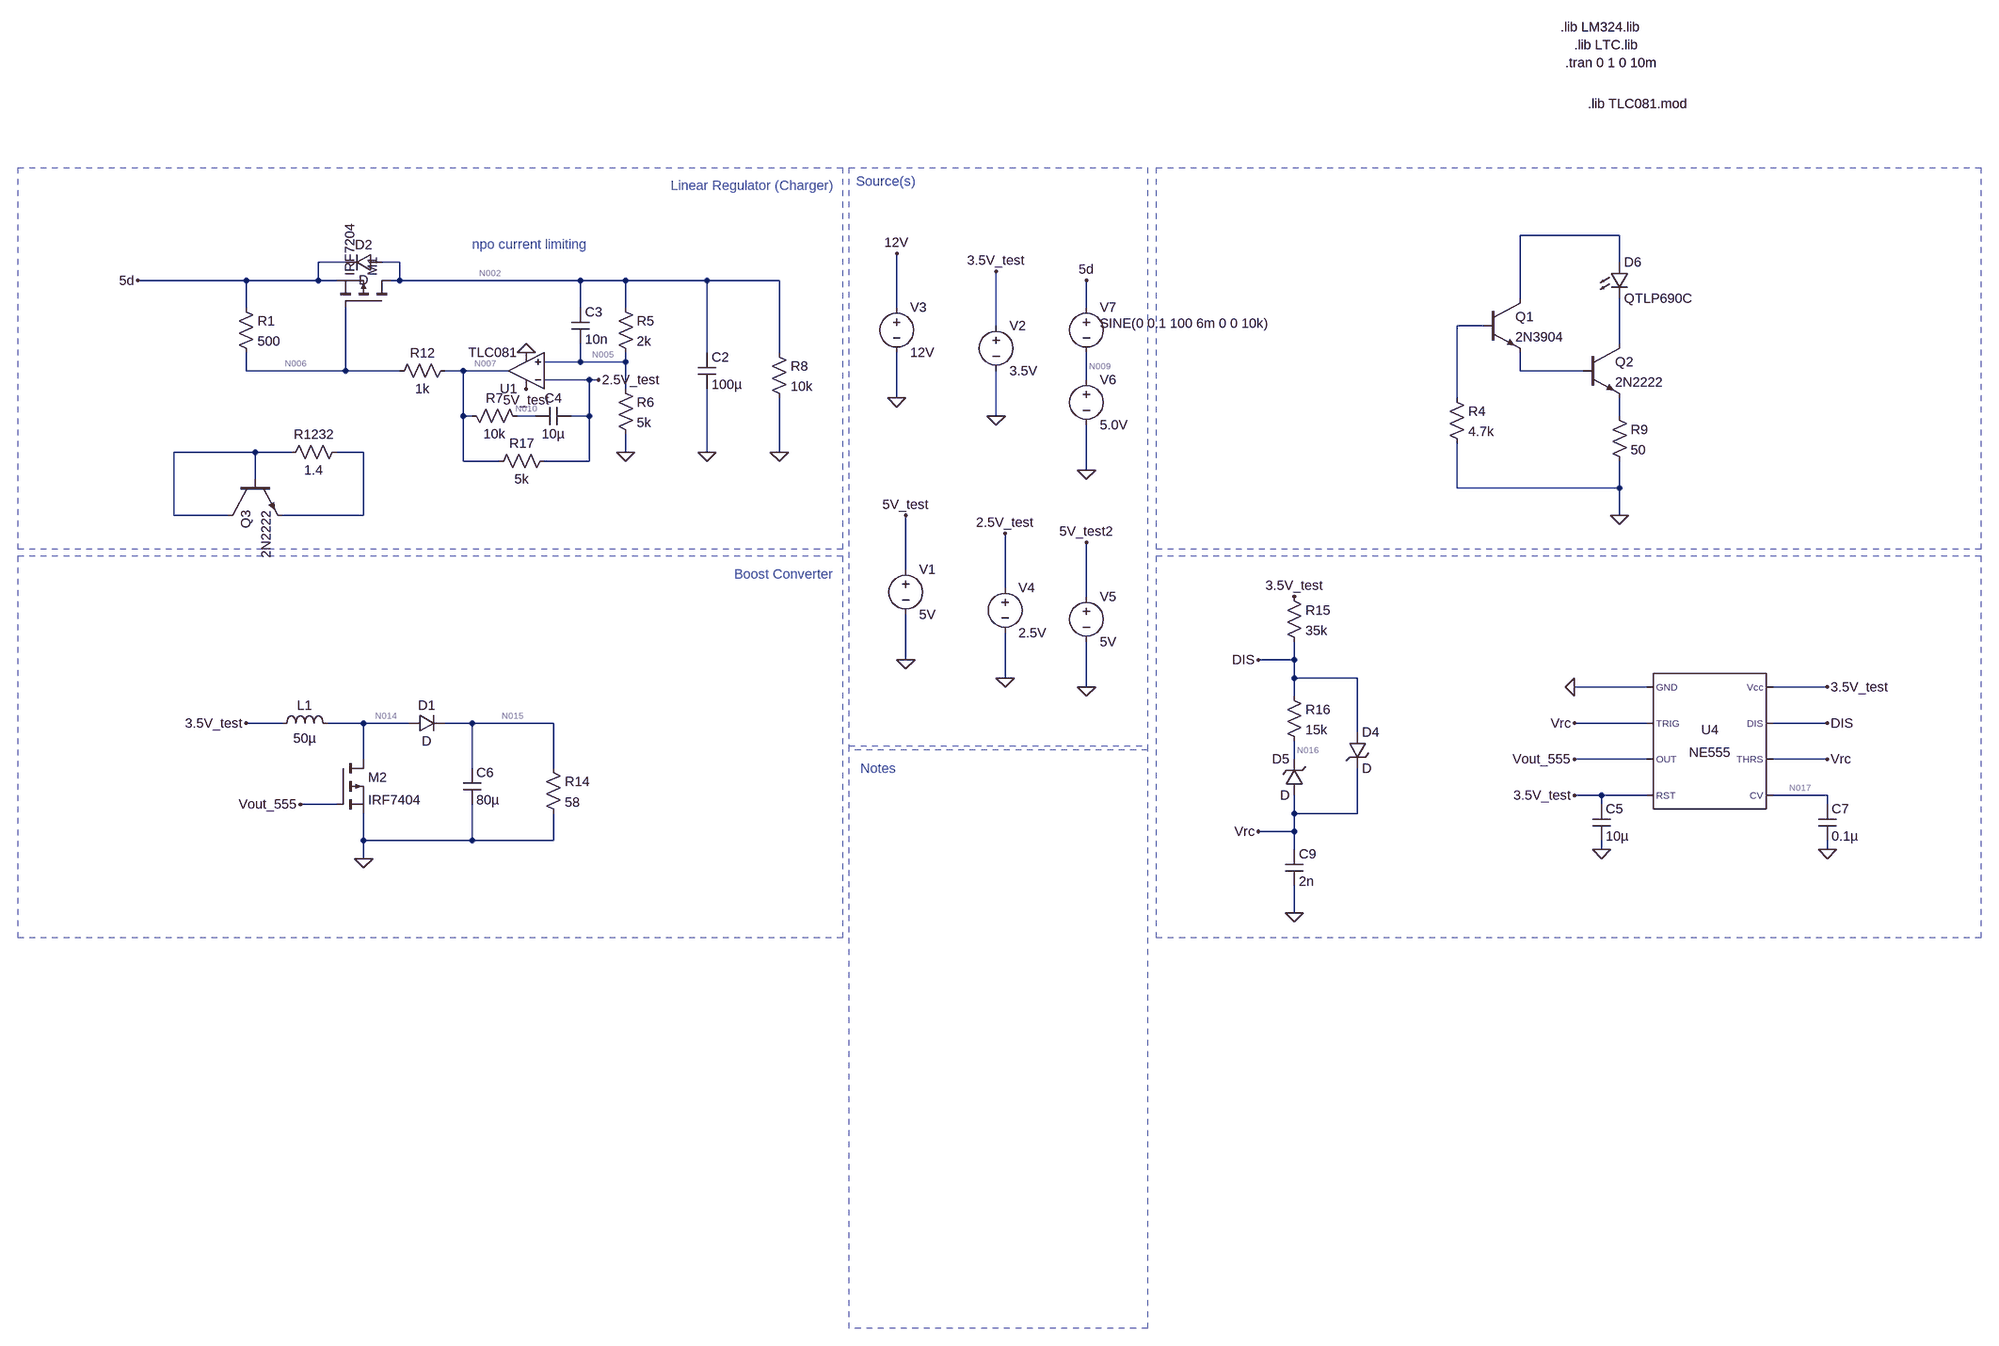
[diagram p0: schematic LTSpice Simulation copy.asc]
LTSpice Simulation copy.asc, the LTspice schematic file:
Version 4.1
SHEET 1 3072 17268
WIRE 640 176 464 176
WIRE -1616 224 -1664 224
WIRE -1520 224 -1552 224
WIRE 640 224 640 176
WIRE -1792 256 -1984 256
WIRE -1664 256 -1664 224
WIRE -1664 256 -1792 256
WIRE -1632 256 -1664 256
WIRE -1520 256 -1520 224
WIRE -1520 256 -1536 256
WIRE -1200 256 -1520 256
WIRE -1120 256 -1200 256
WIRE -976 256 -1120 256
WIRE -848 256 -976 256
WIRE 464 288 464 176
WIRE -1792 304 -1792 256
WIRE -1200 304 -1200 256
WIRE -1120 304 -1120 256
WIRE -640 304 -640 208
WIRE -304 304 -304 256
WIRE -464 336 -464 240
WIRE 400 336 352 336
WIRE 640 368 640 288
WIRE -976 384 -976 256
WIRE -848 384 -848 256
WIRE -1200 400 -1200 368
WIRE -1200 400 -1264 400
WIRE -1120 400 -1120 384
WIRE -1120 400 -1200 400
WIRE -1792 416 -1792 384
WIRE -1616 416 -1616 304
WIRE -1616 416 -1792 416
WIRE -1520 416 -1616 416
WIRE -1408 416 -1440 416
WIRE -1328 416 -1408 416
WIRE 464 416 464 384
WIRE 576 416 464 416
WIRE -1184 432 -1264 432
WIRE -1168 432 -1184 432
WIRE -304 432 -304 384
WIRE -1120 448 -1120 400
WIRE -640 464 -640 384
WIRE 352 464 352 336
WIRE -1408 496 -1408 416
WIRE -1392 496 -1408 496
WIRE -1280 496 -1312 496
WIRE -1184 496 -1184 432
WIRE -1184 496 -1216 496
WIRE -464 496 -464 416
WIRE 640 496 640 464
WIRE -1776 560 -1920 560
WIRE -1712 560 -1776 560
WIRE -1584 560 -1632 560
WIRE -1120 560 -1120 528
WIRE -976 560 -976 448
WIRE -848 560 -848 464
WIRE -1408 576 -1408 496
WIRE -1344 576 -1408 576
WIRE -1184 576 -1184 496
WIRE -1184 576 -1264 576
WIRE -304 592 -304 512
WIRE -1776 608 -1776 560
WIRE 352 624 352 544
WIRE 640 624 640 576
WIRE 640 624 352 624
WIRE -1920 672 -1920 560
WIRE -1824 672 -1920 672
WIRE -1584 672 -1584 560
WIRE -1584 672 -1728 672
WIRE 640 672 640 624
WIRE -624 768 -624 672
WIRE -448 800 -448 704
WIRE -304 816 -304 720
WIRE -624 928 -624 848
WIRE 64 928 64 896
WIRE 64 928 0 928
WIRE -448 960 -448 880
WIRE 64 960 64 928
WIRE 176 960 64 960
WIRE -304 976 -304 896
WIRE 688 976 560 976
WIRE 1008 976 912 976
WIRE 64 992 64 960
WIRE -1728 1040 -1792 1040
WIRE -1584 1040 -1648 1040
WIRE -1504 1040 -1584 1040
WIRE -1392 1040 -1440 1040
WIRE -1248 1040 -1392 1040
WIRE 688 1040 560 1040
WIRE 1008 1040 912 1040
WIRE 176 1056 176 960
WIRE -1584 1104 -1584 1040
WIRE 64 1104 64 1072
WIRE 688 1104 560 1104
WIRE 1008 1104 912 1104
WIRE -1392 1120 -1392 1040
WIRE -1248 1120 -1248 1040
WIRE 608 1168 560 1168
WIRE 688 1168 608 1168
WIRE 1008 1168 912 1168
WIRE -1632 1184 -1696 1184
WIRE 608 1184 608 1168
WIRE 1008 1184 1008 1168
WIRE 64 1200 64 1168
WIRE 176 1200 176 1120
WIRE 176 1200 64 1200
WIRE 64 1232 64 1200
WIRE 64 1232 0 1232
WIRE -1584 1248 -1584 1200
WIRE -1392 1248 -1392 1184
WIRE -1392 1248 -1584 1248
WIRE -1248 1248 -1248 1200
WIRE -1248 1248 -1392 1248
WIRE 64 1264 64 1232
WIRE 608 1264 608 1248
WIRE 1008 1264 1008 1248
WIRE -1584 1280 -1584 1248
WIRE 64 1376 64 1328
FLAG -624 928 0
FLAG -624 672 5V_test
FLAG -640 464 0
FLAG -640 208 12V
FLAG 640 672 0
FLAG -464 496 0
FLAG -464 240 3.5V_test
FLAG -1120 560 0
FLAG -1984 256 5d
FLAG -976 560 0
FLAG -848 560 0
FLAG -1296 448 5V_test
FLAG -1296 384 0
FLAG -448 960 0
FLAG -448 704 2.5V_test
FLAG -1168 432 2.5V_test
FLAG -1696 1184 Vout_555
FLAG -1792 1040 3.5V_test
FLAG 560 1040 Vrc
FLAG 560 976 0
FLAG 1008 976 3.5V_test
FLAG 1008 1040 DIS
FLAG 1008 1104 Vrc
FLAG 64 1376 0
FLAG 64 816 3.5V_test
FLAG 0 1232 Vrc
FLAG 0 928 DIS
FLAG 1008 1264 0
FLAG 608 1264 0
FLAG 560 1168 3.5V_test
FLAG 560 1104 Vout_555
FLAG -304 976 0
FLAG -304 720 5V_test2
FLAG -304 592 0
FLAG -304 256 5d
FLAG -1584 1280 0
SYMBOL Voltage -624 752 R0
SYMATTR InstName V1
SYMATTR Value 5V
SYMBOL Voltage -640 288 R0
SYMATTR InstName V3
SYMATTR Value 12V
SYMBOL npn 400 288 R0
SYMATTR InstName Q1
SYMATTR Value 2N3904
SYMBOL npn 576 368 R0
SYMATTR InstName Q2
SYMATTR Value 2N2222
SYMBOL LED 624 224 R0
SYMATTR InstName D6
SYMATTR Value QTLP690C
SYMBOL Res 336 448 R0
SYMATTR InstName R4
SYMATTR Value 4.7k
SYMBOL Res 624 480 R0
SYMATTR InstName R9
SYMATTR Value 50
SYMBOL Voltage -464 320 R0
SYMATTR InstName V2
SYMATTR Value 3.5V
SYMBOL pmos -1536 304 M270
SYMATTR InstName M1
SYMATTR Value IRF7204
SYMBOL Res -1136 288 R0
SYMATTR InstName R5
SYMATTR Value 2k
SYMBOL Res -1136 432 R0
SYMATTR InstName R6
SYMATTR Value 5k
SYMBOL Res -864 368 R0
SYMATTR InstName R8
SYMATTR Value 10k
SYMBOL Cap -992 384 R0
SYMATTR InstName C2
SYMATTR Value 100µ
SYMBOL Cap -1216 304 R0
SYMATTR InstName C3
SYMATTR Value 10n
SYMBOL Res -1616 544 R90
WINDOW 0 0 56 VBottom 2
WINDOW 3 32 56 VTop 2
SYMATTR InstName R1232
SYMATTR Value 1.4
SYMBOL Cap -1408 1120 R0
SYMATTR InstName C6
SYMATTR Value 80µ
SYMBOL ind -1744 1056 R270
WINDOW 0 32 56 VTop 2
WINDOW 3 5 56 VBottom 2
SYMATTR InstName L1
SYMATTR Value 50µ
SYMBOL Res -1264 1104 R0
SYMATTR InstName R14
SYMATTR Value 58
SYMBOL Diode -1504 1056 R270
WINDOW 0 32 32 VTop 2
WINDOW 3 0 32 VBottom 2
SYMATTR InstName D1
SYMBOL pmos -1632 1104 R0
SYMATTR InstName M2
SYMATTR Value IRF7404
SYMBOL Res -1424 400 R90
WINDOW 0 0 56 VBottom 2
WINDOW 3 32 56 VTop 2
SYMATTR InstName R12
SYMATTR Value 1k
SYMBOL Res -1296 512 M270
WINDOW 0 32 56 VTop 2
WINDOW 3 0 56 VBottom 2
SYMATTR InstName R7
SYMATTR Value 10k
SYMBOL Cap -1216 512 M270
WINDOW 0 32 32 VTop 2
WINDOW 3 0 32 VBottom 2
SYMATTR InstName C4
SYMATTR Value 10µ
SYMBOL Voltage -448 784 R0
SYMATTR InstName V4
SYMATTR Value 2.5V
SYMBOL Misc/NE555 800 1072 R0
SYMATTR InstName U4
SYMBOL Cap 592 1184 R0
SYMATTR InstName C5
SYMATTR Value 10µ
SYMBOL Cap 992 1184 R0
SYMATTR InstName C7
SYMATTR Value 0.1µ
SYMBOL Cap 48 1264 R0
SYMATTR InstName C9
SYMATTR Value 2n
SYMBOL Res 48 800 R0
SYMATTR InstName R15
SYMATTR Value 35k
SYMBOL Res 48 976 R0
SYMATTR InstName R16
SYMATTR Value 15k
SYMBOL zener 160 1056 R0
SYMATTR InstName D4
SYMBOL zener 80 1168 R180
WINDOW 0 24 64 Left 2
WINDOW 3 24 0 Left 2
SYMATTR InstName D5
SYMBOL Voltage -304 800 R0
SYMATTR InstName V5
SYMATTR Value 5V
SYMBOL OpAmps/opamp2 -1296 480 R180
SYMATTR InstName U1
SYMATTR Value TLC081
SYMBOL Res -1248 560 R90
WINDOW 0 0 56 VBottom 2
WINDOW 3 32 56 VTop 2
SYMATTR InstName R17
SYMATTR Value 5k
SYMBOL Diode -1552 208 R90
WINDOW 0 0 32 VBottom 2
WINDOW 3 32 32 VTop 2
SYMATTR InstName D2
SYMBOL Voltage -304 416 R0
SYMATTR InstName V6
SYMATTR Value 5.0V
SYMBOL Voltage -304 288 R0
WINDOW 3 24 44 Left 2
WINDOW 123 0 0 Left 0
WINDOW 39 0 0 Left 0
SYMATTR InstName V7
SYMATTR Value SINE(0 0.1 100 6m 0 0 10k)
SYMBOL npn -1824 608 M90
SYMATTR InstName Q3
SYMATTR Value 2N2222
SYMBOL res -1808 288 R0
SYMATTR InstName R1
SYMATTR Value 500
TEXT 536 -640 Left 2 !.lib LM324.lib
TEXT 544 -576 Left 2 !.tran 0 1 0 10m
TEXT 560 -608 Left 2 !.lib LTC.lib
TEXT -704 1120 Left 2 ;Notes
TEXT -712 80 Left 2 ;Source(s)
TEXT -1040 88 Left 2 ;Linear Regulator (Charger)
TEXT -928 776 Left 2 ;Boost Converter
TEXT 584 -504 Left 2 !.lib TLC081.mod
TEXT -1392 192 Left 2 ;npo current limiting
RECTANGLE Normal -724 56 -196 1088 2
RECTANGLE Normal -180 56 1280 732 2
RECTANGLE Normal -180 744 1280 1420 2
RECTANGLE Normal -724 1080 -196 2112 2
RECTANGLE Normal -2196 56 -736 732 2
RECTANGLE Normal -2196 744 -736 1420 2

The netlist it stands for:
* LTSpice Simulation copy.asc
V1 5V_test 0 5V
V3 12V 0 12V
Q1 N001 N003 N008 0 2N3904
Q2 N004 N008 N011 0 2N2222
D6 N001 N004 QTLP690C
R4 N003 0 4.7k
R9 N011 0 50
V2 3.5V_test 0 3.5V
M1 N002 N006 5d 5d IRF7204
R5 N002 N005 2k
R6 N005 0 5k
R8 N002 0 10k
C2 N002 0 100µ
C3 N002 N005 10n
R1232 N013 N012 1.4
C6 N015 0 80µ
L1 3.5V_test N014 50µ
R14 N015 0 58
D1 N014 N015 D
M2 N014 Vout_555 0 0 IRF7404
R12 N007 N006 1k
R7 N010 N007 10k
C4 2.5V_test N010 10µ
V4 2.5V_test 0 2.5V
X§U4 0 Vrc Vout_555 3.5V_test N017 Vrc DIS 3.5V_test NE555  ; pins GND TRIG OUT RST CV THRS DIS Vcc
C5 3.5V_test 0 10µ
C7 N017 0 0.1µ
C9 Vrc 0 2n
R15 3.5V_test DIS 35k
R16 DIS N016 15k
D4 DIS Vrc D
D5 Vrc N016 D
V5 5V_test2 0 5V
X§U1 N005 2.5V_test 5V_test 0 N007 TLC081  ; pins In+ In- V+ V- OUT
R17 2.5V_test N007 5k
D2 N002 5d D
V6 N009 0 5.0V
V7 5d N009 SINE(0 0.1 100 6m 0 0 10k)
Q3 N012 N012 N013 0 2N2222
R1 5d N006 500
.model D D
.lib standard.dio
.model NPN NPN
.model PNP PNP
.lib standard.bjt
.model NMOS NMOS
.model PMOS PMOS
.lib standard.mos
.lib LM324.lib
.tran 0 1 0 10m
.lib LTC.lib
* Notes
* Source(s)
* Linear Regulator (Charger)
* Boost Converter
.lib TLC081.mod
* npo current limiting
.lib NE555.sub
.backanno
.end

* Results of the author's LTspice run, read from the files saved beside the schematic
* Operating Point, zero values left out:
*   V(12v) = 12 V
*   V(2.5v_test) = 2.5 V
*   V(3.5v_test) = 3.5 V
*   V(5d) = 5 V
*   V(5v_test) = 5 V
*   V(5v_test2) = 5 V
*   V(dis) = 3.5 V
*   V(n002) = 3.499 V
*   V(n005) = 2.499 V
*   V(n006) = 4.219 V
*   V(n007) = 2.656 V
*   V(n009) = 5 V
*   V(n010) = 2.656 V
*   V(n014) = 3.368 V
*   V(n015) = 2.614 V
*   V(n016) = 3.5 V
*   V(n017) = 2.333 V
*   V(vout_555) = 3.5 V
*   V(vrc) = 3.154 V
*   I(D1) = 45.07 mA
*   I(D2) = -1.511 pA
*   I(D4) = 6.308 nA
*   I(L1) = 132.1 A
*   I(R1) = 1.563 mA
*   I(R12) = -1.563 mA
*   I(R14) = 45.07 mA
*   I(R15) = 10.98 nA
*   I(R17) = -31.18 µA
*   I(R5) = 499.9 µA
*   I(R6) = 499.9 µA
*   I(R8) = 349.9 µA
*   I(V1) = -955.7 µA
*   I(V2) = -132.1 A
*   I(V4) = 31.18 µA
*   I(V6) = -2.413 mA
*   I(V7) = -2.413 mA
*   Id(M1) = -849.8 µA
*   Id(M2) = 132 A
*   Is(M1) = 849.8 µA
*   Is(M2) = -132 A
*   Ix(u1:1) = 3.13 pA
*   Ix(u1:2) = 3.132 pA
*   Ix(u1:3) = 955.7 µA
*   Ix(u1:4) = -956.2 µA
*   Ix(u1:5) = 1.532 mA
*   Ix(u4:1) = -1.125 mA
*   Ix(u4:2) = 3.154 nA
*   Ix(u4:4) = 12.67 µA
*   Ix(u4:6) = 3.154 nA
*   Ix(u4:7) = 4.67 nA
*   Ix(u4:8) = 1.112 mA